# EAGLE schematic controller-SCH (EAGLE 8.7.0)
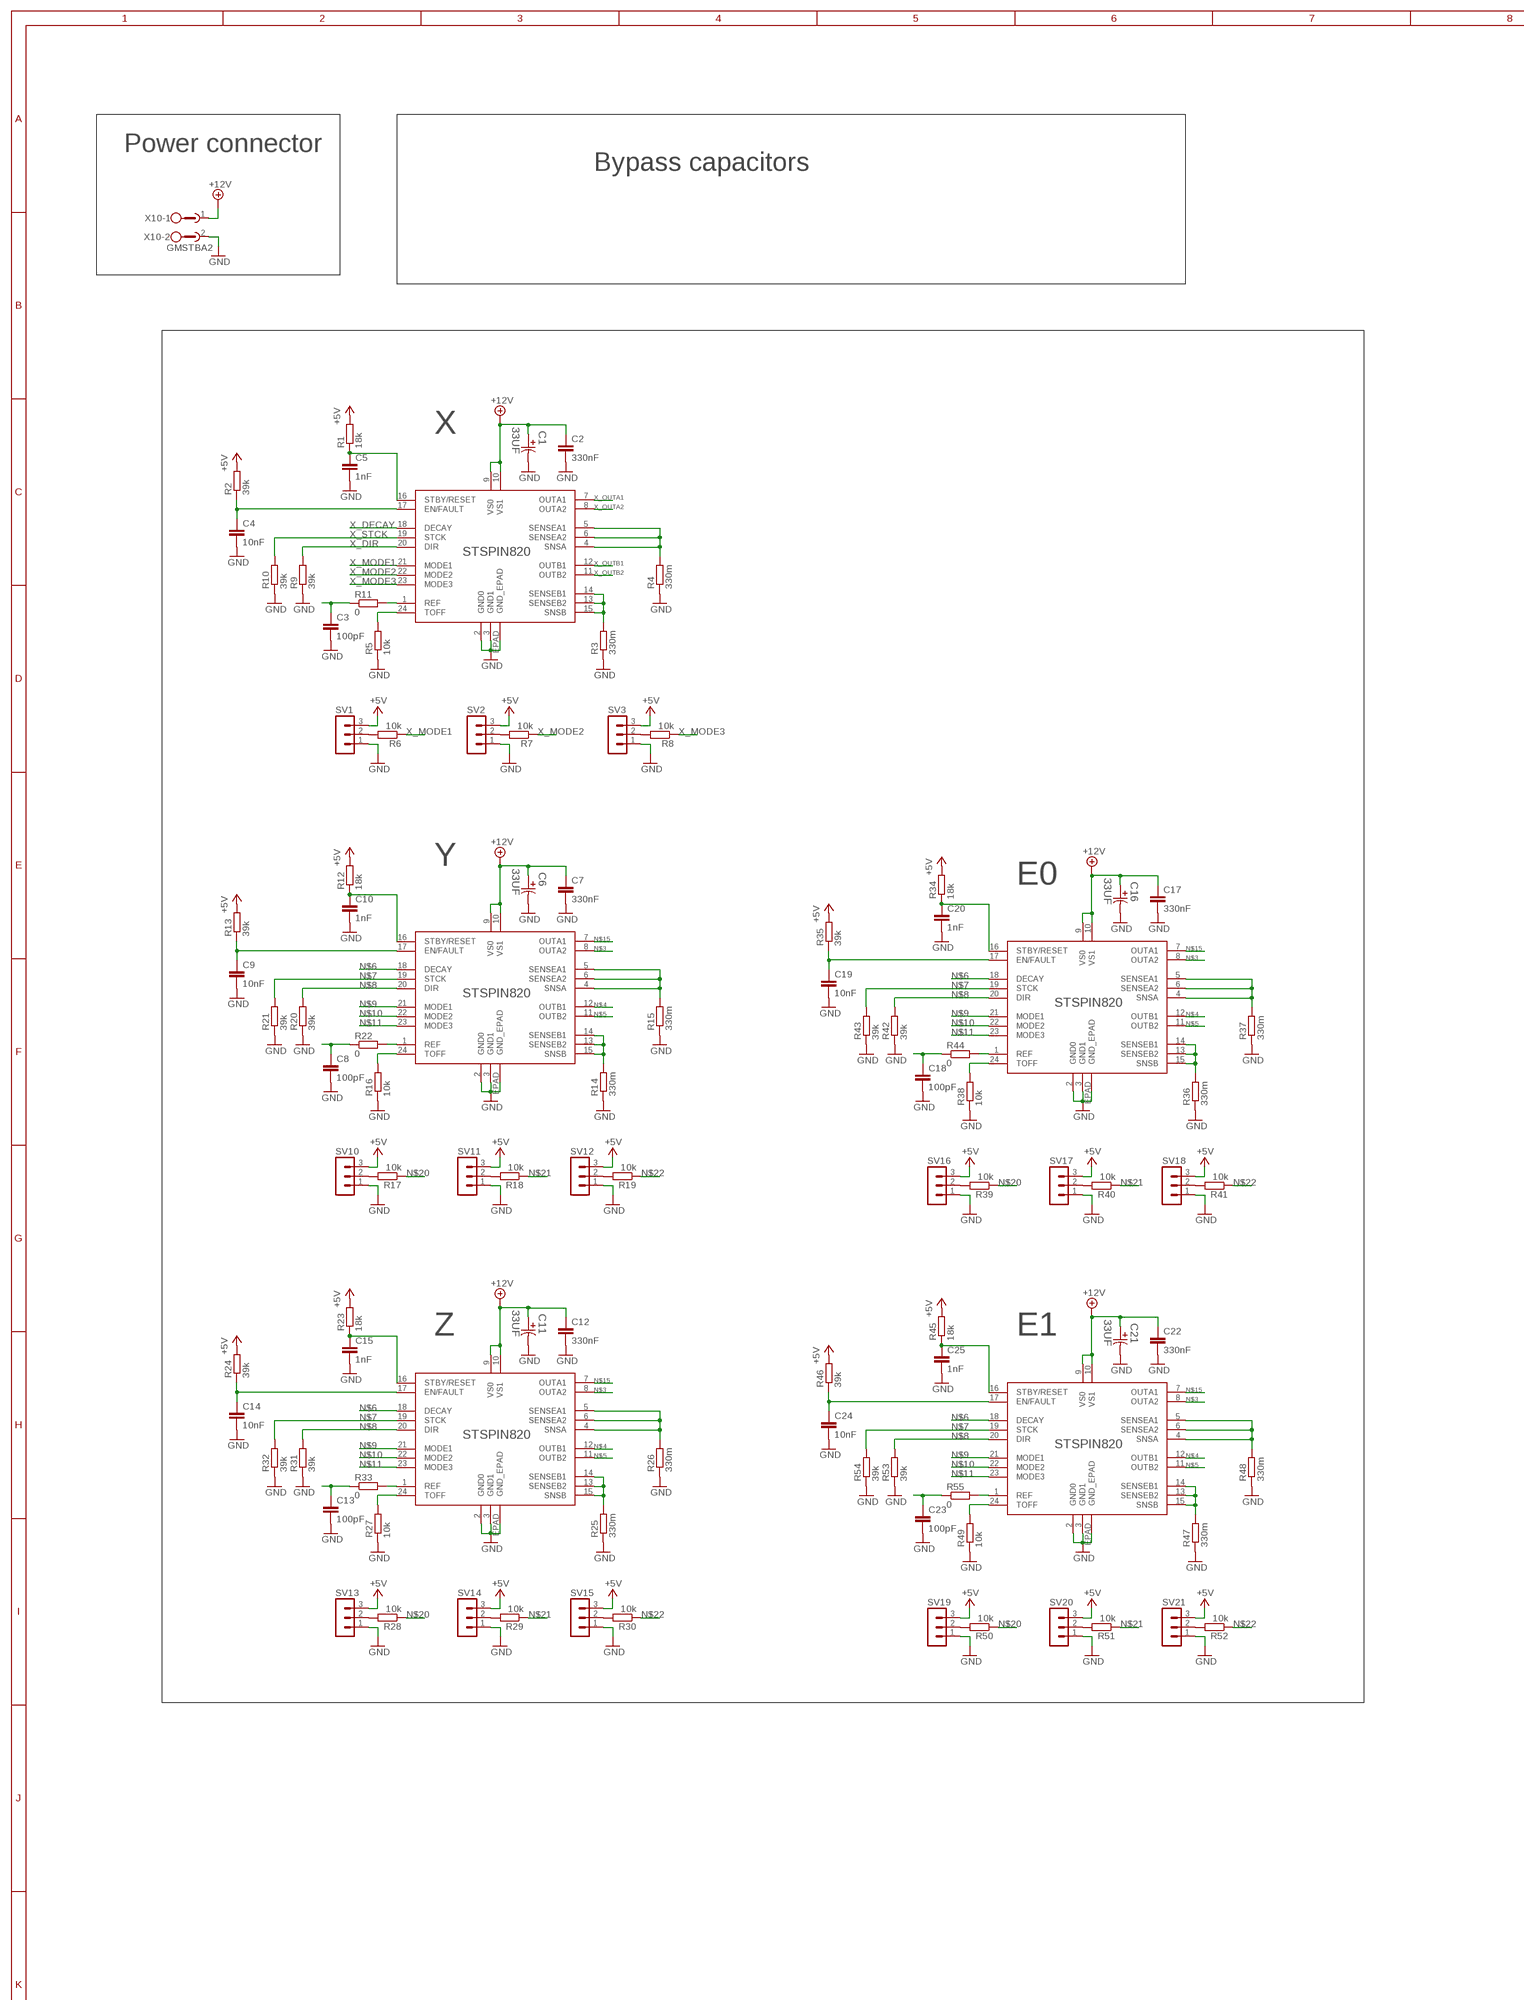
[diagram p0: schematic, sheet 1, part 1 of 3]
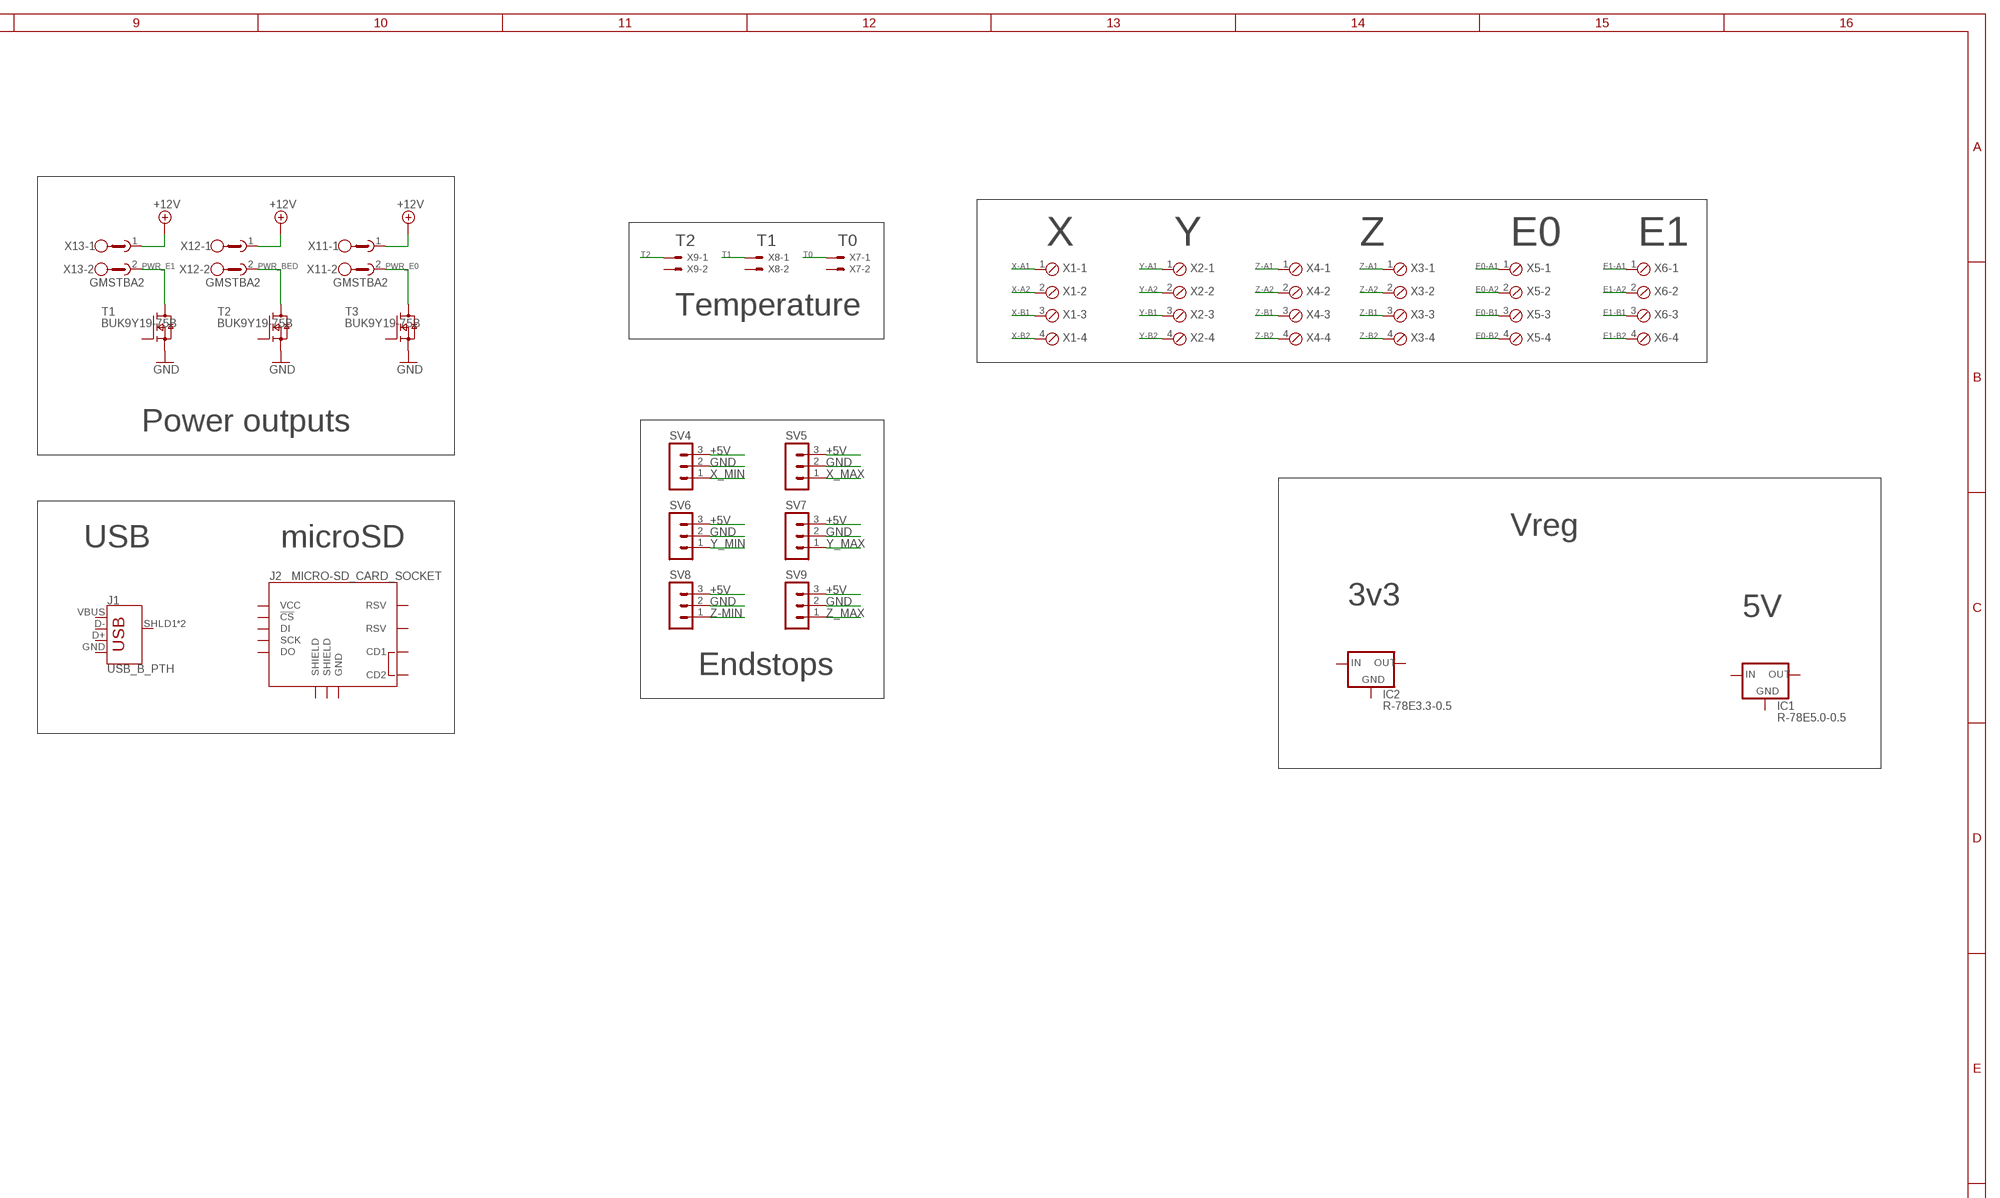
[diagram p1: schematic, sheet 1, part 2 of 3]
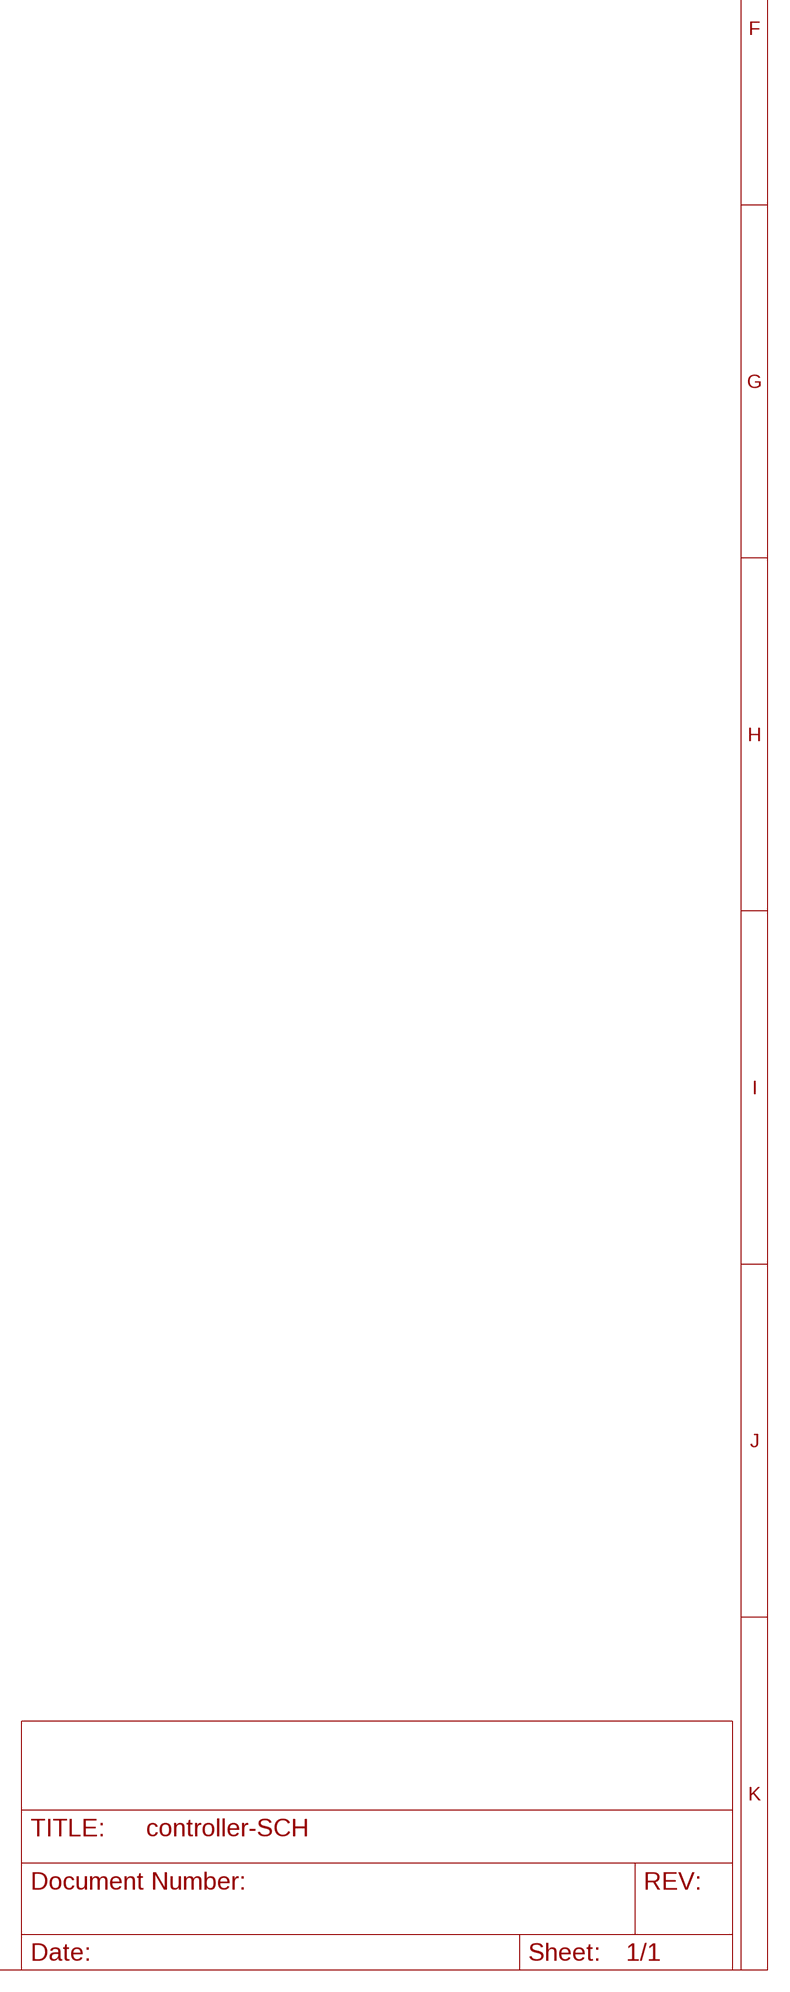
[diagram p2: schematic, sheet 1, part 3 of 3]

## Parts
C1  33UF  EEE-FK1H330P-CASE-E  [CAPAE830X650N]
C2  330nF  C-EUC0805  [C0805]
C3  100pF  C-EUC0805  [C0805]
C4  10nF  C-EUC0805  [C0805]
C5  1nF  C-EUC0805  [C0805]
C6  33UF  EEE-FK1H330P-CASE-E  [CAPAE830X650N]
C7  330nF  C-EUC0805  [C0805]
C8  100pF  C-EUC0805  [C0805]
C9  10nF  C-EUC0805  [C0805]
C10  1nF  C-EUC0805  [C0805]
C11  33UF  EEE-FK1H330P-CASE-E  [CAPAE830X650N]
C12  330nF  C-EUC0805  [C0805]
C13  100pF  C-EUC0805  [C0805]
C14  10nF  C-EUC0805  [C0805]
C15  1nF  C-EUC0805  [C0805]
C16  33UF  EEE-FK1H330P-CASE-E  [CAPAE830X650N]
C17  330nF  C-EUC0805  [C0805]
C18  100pF  C-EUC0805  [C0805]
C19  10nF  C-EUC0805  [C0805]
C20  1nF  C-EUC0805  [C0805]
C21  33UF  EEE-FK1H330P-CASE-E  [CAPAE830X650N]
C22  330nF  C-EUC0805  [C0805]
C23  100pF  C-EUC0805  [C0805]
C24  10nF  C-EUC0805  [C0805]
C25  1nF  C-EUC0805  [C0805]
IC1  R-78E5.0-0.5  [SIP3]
IC2  R-78E3.3-0.5  [SIP3]
J1  USB_B_PTH  [USB-B-PTH]
J2  MICRO-SD_CARD_SOCKET  [MICRO-SD-SOCKET]
R1  18k  R-EU_R0805  [R0805]
R2  39k  R-EU_R0805  [R0805]
R3  330m  R-EU_R2512  [R2512]
R4  330m  R-EU_R2512  [R2512]
R5  10k  R-EU_R0805  [R0805]
R6  10k  R-EU_R0805  [R0805]
R7  10k  R-EU_R0805  [R0805]
R8  10k  R-EU_R0805  [R0805]
R9  39k  R-EU_R0805  [R0805]
R10  39k  R-EU_R0805  [R0805]
R11  0  R-EU_R0805  [R0805]
R12  18k  R-EU_R0805  [R0805]
R13  39k  R-EU_R0805  [R0805]
R14  330m  R-EU_R2512  [R2512]
R15  330m  R-EU_R2512  [R2512]
R16  10k  R-EU_R0805  [R0805]
R17  10k  R-EU_R0805  [R0805]
R18  10k  R-EU_R0805  [R0805]
R19  10k  R-EU_R0805  [R0805]
R20  39k  R-EU_R0805  [R0805]
R21  39k  R-EU_R0805  [R0805]
R22  0  R-EU_R0805  [R0805]
R23  18k  R-EU_R0805  [R0805]
R24  39k  R-EU_R0805  [R0805]
R25  330m  R-EU_R2512  [R2512]
R26  330m  R-EU_R2512  [R2512]
R27  10k  R-EU_R0805  [R0805]
R28  10k  R-EU_R0805  [R0805]
R29  10k  R-EU_R0805  [R0805]
R30  10k  R-EU_R0805  [R0805]
R31  39k  R-EU_R0805  [R0805]
R32  39k  R-EU_R0805  [R0805]
R33  0  R-EU_R0805  [R0805]
R34  18k  R-EU_R0805  [R0805]
R35  39k  R-EU_R0805  [R0805]
R36  330m  R-EU_R2512  [R2512]
R37  330m  R-EU_R2512  [R2512]
R38  10k  R-EU_R0805  [R0805]
R39  10k  R-EU_R0805  [R0805]
R40  10k  R-EU_R0805  [R0805]
R41  10k  R-EU_R0805  [R0805]
R42  39k  R-EU_R0805  [R0805]
R43  39k  R-EU_R0805  [R0805]
R44  0  R-EU_R0805  [R0805]
R45  18k  R-EU_R0805  [R0805]
R46  39k  R-EU_R0805  [R0805]
R47  330m  R-EU_R2512  [R2512]
R48  330m  R-EU_R2512  [R2512]
R49  10k  R-EU_R0805  [R0805]
R50  10k  R-EU_R0805  [R0805]
R51  10k  R-EU_R0805  [R0805]
R52  10k  R-EU_R0805  [R0805]
R53  39k  R-EU_R0805  [R0805]
R54  39k  R-EU_R0805  [R0805]
R55  0  R-EU_R0805  [R0805]
SV1  MA03-1  [MA03-1]
SV2  MA03-1  [MA03-1]
SV3  MA03-1  [MA03-1]
SV4  MA03-1  [MA03-1]
SV5  MA03-1  [MA03-1]
SV6  MA03-1  [MA03-1]
SV7  MA03-1  [MA03-1]
SV8  MA03-1  [MA03-1]
SV9  MA03-1  [MA03-1]
SV10  MA03-1  [MA03-1]
SV11  MA03-1  [MA03-1]
SV12  MA03-1  [MA03-1]
SV13  MA03-1  [MA03-1]
SV14  MA03-1  [MA03-1]
SV15  MA03-1  [MA03-1]
SV16  MA03-1  [MA03-1]
SV17  MA03-1  [MA03-1]
SV18  MA03-1  [MA03-1]
SV19  MA03-1  [MA03-1]
SV20  MA03-1  [MA03-1]
SV21  MA03-1  [MA03-1]
T1  BUK9Y19-75B  [SOT669]
T2  BUK9Y19-75B  [SOT669]
T3  BUK9Y19-75B  [SOT669]
U$1  STSPIN820  [QFN4X4]
U$2  STSPIN820  [QFN4X4]
U$3  STSPIN820  [QFN4X4]
U$4  STSPIN820  [QFN4X4]
U$5  STSPIN820  [QFN4X4]
X1  MPT4  [4POL254]
X2  MPT4  [4POL254]
X3  MPT4  [4POL254]
X4  MPT4  [4POL254]
X5  MPT4  [4POL254]
X6  MPT4  [4POL254]
X7  22-23-2021  [22-23-2021]
X8  22-23-2021  [22-23-2021]
X9  22-23-2021  [22-23-2021]
X10  GMSTBA2  [GMSTBA2]
X11  GMSTBA2  [GMSTBA2]
X12  GMSTBA2  [GMSTBA2]
X13  GMSTBA2  [GMSTBA2]

## Nets
+5V: R1.2 R2.2 R12.2 R13.2 R23.2 R24.2 R34.2 R35.2 R45.2 R46.2 SV1.3 SV2.3 SV3.3 SV4.3 SV5.3 SV6.3 SV7.3 SV8.3 SV9.3 SV10.3 SV11.3 SV12.3 SV13.3 SV14.3 SV15.3 SV16.3 SV17.3 SV18.3 SV19.3 SV20.3 SV21.3
+12V: C1.1 C2.1 C6.1 C7.1 C11.1 C12.1 C16.1 C17.1 C21.1 C22.1 U$1.9(VS0) U$1.10(VS1) U$2.9(VS0) U$2.10(VS1) U$3.9(VS0) U$3.10(VS1) U$4.9(VS0) U$4.10(VS1) U$5.9(VS0) U$5.10(VS1) X10.1 X11.1 X12.1 X13.1
E0-A1: X5.1
E0-A2: X5.2
E0-B1: X5.3
E0-B2: X5.4
E1-A1: X6.1
E1-A2: X6.2
E1-B1: X6.3
E1-B2: X6.4
GND: C1.2 C2.2 C3.2 C4.2 C5.2 C6.2 C7.2 C8.2 C9.2 C10.2 C11.2 C12.2 C13.2 C14.2 C15.2 C16.2 C17.2 C18.2 C19.2 C20.2 C21.2 C22.2 C23.2 C24.2 C25.2 R3.1 R4.1 R5.1 R9.1 R10.1 R14.1 R15.1 R16.1 R20.1 R21.1 R25.1 R26.1 R27.1 R31.1 R32.1 R36.1 R37.1 R38.1 R42.1 R43.1 R47.1 R48.1 R49.1 R53.1 R54.1 SV1.1 SV2.1 SV3.1 SV4.2 SV5.2 SV6.2 SV7.2 SV8.2 SV9.2 SV10.1 SV11.1 SV12.1 SV13.1 SV14.1 SV15.1 SV16.1 SV17.1 SV18.1 SV19.1 SV20.1 SV21.1 T1.1(S) T1.2(S) T1.3(S) T2.1(S) T2.2(S) T2.3(S) T3.1(S) T3.2(S) T3.3(S) U$1.2(GND0) U$1.3(GND1) U$1.EPAD(GND_EPAD) U$2.2(GND0) U$2.3(GND1) U$2.EPAD(GND_EPAD) U$3.2(GND0) U$3.3(GND1) U$3.EPAD(GND_EPAD) U$4.2(GND0) U$4.3(GND1) U$4.EPAD(GND_EPAD) U$5.2(GND0) U$5.3(GND1) U$5.EPAD(GND_EPAD) X10.2
N$1: C5.1 R1.1 U$1.16(STBY/RESET)
N$2: C4.1 R2.1 U$1.17(EN/FAULT)
N$3: U$2.8(OUTA2) U$3.8(OUTA2) U$4.8(OUTA2) U$5.8(OUTA2)
N$4: U$2.12(OUTB1) U$3.12(OUTB1) U$4.12(OUTB1) U$5.12(OUTB1)
N$5: U$2.11(OUTB2) U$3.11(OUTB2) U$4.11(OUTB2) U$5.11(OUTB2)
N$6: U$2.18(DECAY) U$3.18(DECAY) U$4.18(DECAY) U$5.18(DECAY)
N$7: R21.2 R32.2 R43.2 R54.2 U$2.19(STCK) U$3.19(STCK) U$4.19(STCK) U$5.19(STCK)
N$8: R20.2 R31.2 R42.2 R53.2 U$2.20(DIR) U$3.20(DIR) U$4.20(DIR) U$5.20(DIR)
N$9: U$2.21(MODE1) U$3.21(MODE1) U$4.21(MODE1) U$5.21(MODE1)
N$10: U$2.22(MODE2) U$3.22(MODE2) U$4.22(MODE2) U$5.22(MODE2)
N$11: U$2.23(MODE3) U$3.23(MODE3) U$4.23(MODE3) U$5.23(MODE3)
N$12: R11.2 U$1.1(REF)
N$13: R5.2 U$1.24(TOFF)
N$14: R4.2 U$1.4(SNSA) U$1.5(SENSEA1) U$1.6(SENSEA2)
N$15: U$2.7(OUTA1) U$3.7(OUTA1) U$4.7(OUTA1) U$5.7(OUTA1)
N$16: R6.2 SV1.2
N$17: R3.2 U$1.13(SENSEB2) U$1.14(SENSEB1) U$1.15(SNSB)
N$18: R7.2 SV2.2
N$19: R8.2 SV3.2
N$20: R17.1 R28.1 R39.1 R50.1
N$21: R18.1 R29.1 R40.1 R51.1
N$22: R19.1 R30.1 R41.1 R52.1
N$23: C3.1 R11.1
N$24: C9.1 R13.1 U$2.17(EN/FAULT)
N$25: R16.2 U$2.24(TOFF)
N$26: R14.2 U$2.13(SENSEB2) U$2.14(SENSEB1) U$2.15(SNSB)
N$27: R15.2 U$2.4(SNSA) U$2.5(SENSEA1) U$2.6(SENSEA2)
N$28: C10.1 R12.1 U$2.16(STBY/RESET)
N$29: R17.2 SV10.2
N$30: R18.2 SV11.2
N$31: R19.2 SV12.2
N$32: R22.2 U$2.1(REF)
N$33: C8.1 R22.1
N$34: C14.1 R24.1 U$3.17(EN/FAULT)
N$35: R27.2 U$3.24(TOFF)
N$36: R25.2 U$3.13(SENSEB2) U$3.14(SENSEB1) U$3.15(SNSB)
N$37: R26.2 U$3.4(SNSA) U$3.5(SENSEA1) U$3.6(SENSEA2)
N$38: C15.1 R23.1 U$3.16(STBY/RESET)
N$39: R28.2 SV13.2
N$40: R29.2 SV14.2
N$41: R30.2 SV15.2
N$42: R33.2 U$3.1(REF)
N$43: C13.1 R33.1
N$44: C19.1 R35.1 U$4.17(EN/FAULT)
N$45: R38.2 U$4.24(TOFF)
N$46: R36.2 U$4.13(SENSEB2) U$4.14(SENSEB1) U$4.15(SNSB)
N$47: R37.2 U$4.4(SNSA) U$4.5(SENSEA1) U$4.6(SENSEA2)
N$48: C20.1 R34.1 U$4.16(STBY/RESET)
N$49: R39.2 SV16.2
N$50: R40.2 SV17.2
N$51: R41.2 SV18.2
N$52: R44.2 U$4.1(REF)
N$53: C18.1 R44.1
N$54: C24.1 R46.1 U$5.17(EN/FAULT)
N$55: R49.2 U$5.24(TOFF)
N$56: R47.2 U$5.13(SENSEB2) U$5.14(SENSEB1) U$5.15(SNSB)
N$57: R48.2 U$5.4(SNSA) U$5.5(SENSEA1) U$5.6(SENSEA2)
N$58: C25.1 R45.1 U$5.16(STBY/RESET)
N$59: R50.2 SV19.2
N$60: R51.2 SV20.2
N$61: R52.2 SV21.2
N$62: R55.2 U$5.1(REF)
N$63: C23.1 R55.1
PWR_BED: T2.MB(D)
PWR_E0: T3.MB(D)
PWR_E1: T1.MB(D)
T0: X7.1
T1: X8.1
T2: X9.1
X-A1: X1.1
X-A2: X1.2
X-B1: X1.3
X-B2: X1.4
X_DECAY: U$1.18(DECAY)
X_DIR: R9.2 U$1.20(DIR)
X_MAX: SV5.1
X_MIN: SV4.1
X_MODE1: R6.1 U$1.21(MODE1)
X_MODE2: R7.1 U$1.22(MODE2)
X_MODE3: R8.1 U$1.23(MODE3)
X_OUTA1: U$1.7(OUTA1)
X_OUTA2: U$1.8(OUTA2)
X_OUTB1: U$1.12(OUTB1)
X_OUTB2: U$1.11(OUTB2)
X_STCK: R10.2 U$1.19(STCK)
Y-A1: X2.1
Y-A2: X2.2
Y-B1: X2.3
Y-B2: X2.4
Y_MAX: SV7.1
Y_MIN: SV6.1
Z-A1: X3.1 X4.1
Z-A2: X3.2 X4.2
Z-B1: X3.3 X4.3
Z-B2: X3.4 X4.4
Z-MIN: SV8.1
Z_MAX: SV9.1
Unconnected: IC1.1(IN) IC1.2(GND) IC1.3(OUT) IC2.1(IN) IC2.2(GND) IC2.3(OUT) J1.D+ J1.D- J1.SHLD1(SHIELD) J1.SHLD2(SHIELD) J2.CD1 J2.CD2 J2.CS(!CS) J2.DI J2.DO J2.GND J2.GND1(SHIELD) J2.GND3(SHIELD) J2.RSV1(RSV) J2.RSV2(RSV) J2.SCLK(SCK) J2.VCC T1.4(G) T2.4(G) T3.4(G) X7.2 X8.2 X9.2 X11.2 X12.2 X13.2

## Notes on the sheet
- Power connector
- Bypass capacitors
- T2 | T1 | T0 | X | Y | Z | E0 | E1
- Temperature
- Power outputs
- X | Vreg
- USB | microSD
- 3v3
- 5V
- Endstops
- Y
- E0
- Z | E1

## Power pins joined to a net without a drawn wire
GND: J1.GND
VBUS: J1.VBUS

## Library data of the parts
C1 C6 C11 C16 C21 = Panasonic-EEEFK_EEEFP:EEE-: Aluminum Electrolytic Capacitors,Surface Mount Type; MPN: EEE-FK1H330P; OC_FARNELL: 9695923; OC_NEWARK: 96K9395; PACKAGE: CASE-E; SUPPLIER: PANASONIC; TOLERANCE: ±20 %; VOLTAGERATING: 50V
C2-C5 C7-C10 C12-C15 C17-C20 C22-C25 = rcl:C-EU: CAPACITOR, European symbol; SPICEPREFIX: C
IC1 = r-78xx_10:R-78E*-0.5: Innoline R-78xx-0.5 Series Switching Regulators - 0.5A, Low Cost Source: http://www.recom-international.com/pdf/Innoline/R-78Exx-0.5.pdf; MF: Recom; MPN: R-785.0-0.5; OC_FARNELL: 2078564; OC_NEWARK: 62X9499
IC2 = r-78xx_10:R-78E*-0.5: Innoline R-78xx-0.5 Series Switching Regulators - 0.5A, Low Cost Source: http://www.recom-international.com/pdf/Innoline/R-78Exx-0.5.pdf; MF: Recom; MPN: R-783.3-0.5; OC_FARNELL: unknown; OC_NEWARK: 62X9498
J1 = SparkFun-Connectors:USB_B: USB Type B Connector SparkFun Products: SparkFun Stepoko <https://www.sparkfun.com/products/13899> PTH; PROD_ID: CONN-08278; SF_ID: PRT-00139
J2 = SparkFun-Connectors:MICRO-SD_CARD_SOCKET: microSD Socket for Transflash Push-push type µSD socket. tDoc lines correctly indicate media card edge positions when inserting (unlocked, locked, depressed). NOTE: CD1 and CD2 are connected internally, and the default detect state of the socket is detect pin to ground. SparkFun Products: WAV Trigger <https://www.sparkfun.com/products/13660> CAN-Bus Shield <https://www.sparkfun.com/products/13262> SparkFun Level Shifing microSD Breakout <https://www.sparkfun.com/products/13743>; LINK: https://www.sparkfun.com/products/127; PROD_ID: CONN-07820; SF_ID: PRT-00127
R1-R10 R12-R21 R23-R32 R34-R43 R45-R54 = resistor:R-EU_: RESISTOR, European symbol
R11 R22 R33 R44 R55 = rcl:R-EU_: RESISTOR, European symbol; SPICEPREFIX: R
SV1-SV21 = con-lstb:MA03-1: PIN HEADER; OC_FARNELL: unknown; OC_NEWARK: unknown
T1-T3 = nxp_60_1_1:BUK9Y19: N-channel TrenchMOS logic level FET Logic level N-channel enhancement mode Field-Effect Transistor (FET) in a plastic package using TrenchMOS technology. This product has been designed and qualified to the appropriate AEC standard for use in automotive critical applications. AAL Eindhoven MK; LINK: https://fr.rs-online.com/web/p/transistors-mosfet/1532923/; REF: BUK9Y29-40E; RS: 153-2923
U$1-U$5 = STSPIN820:STSPIN820
X1-X6 = con-phoenix-254:MPT4: PHOENIX CONNECTOR; OC_FARNELL: unknown; OC_NEWARK: unknown
X7-X9 = con-molex:22-23-2021: .100" (2.54mm) Center Header - 2 Pin; MF: MOLEX; MPN: 22-23-2021; OC_FARNELL: 1462926; OC_NEWARK: 25C3832
X10-X13 = con-phoenix-762:GMSTBA2: PHOENIX; MF: FARNELL; MPN: 1757242; OC_FARNELL: 3705171; OC_NEWARK: 71C4161